# EAGLE design WyLight_v6 (EAGLE 6.4)
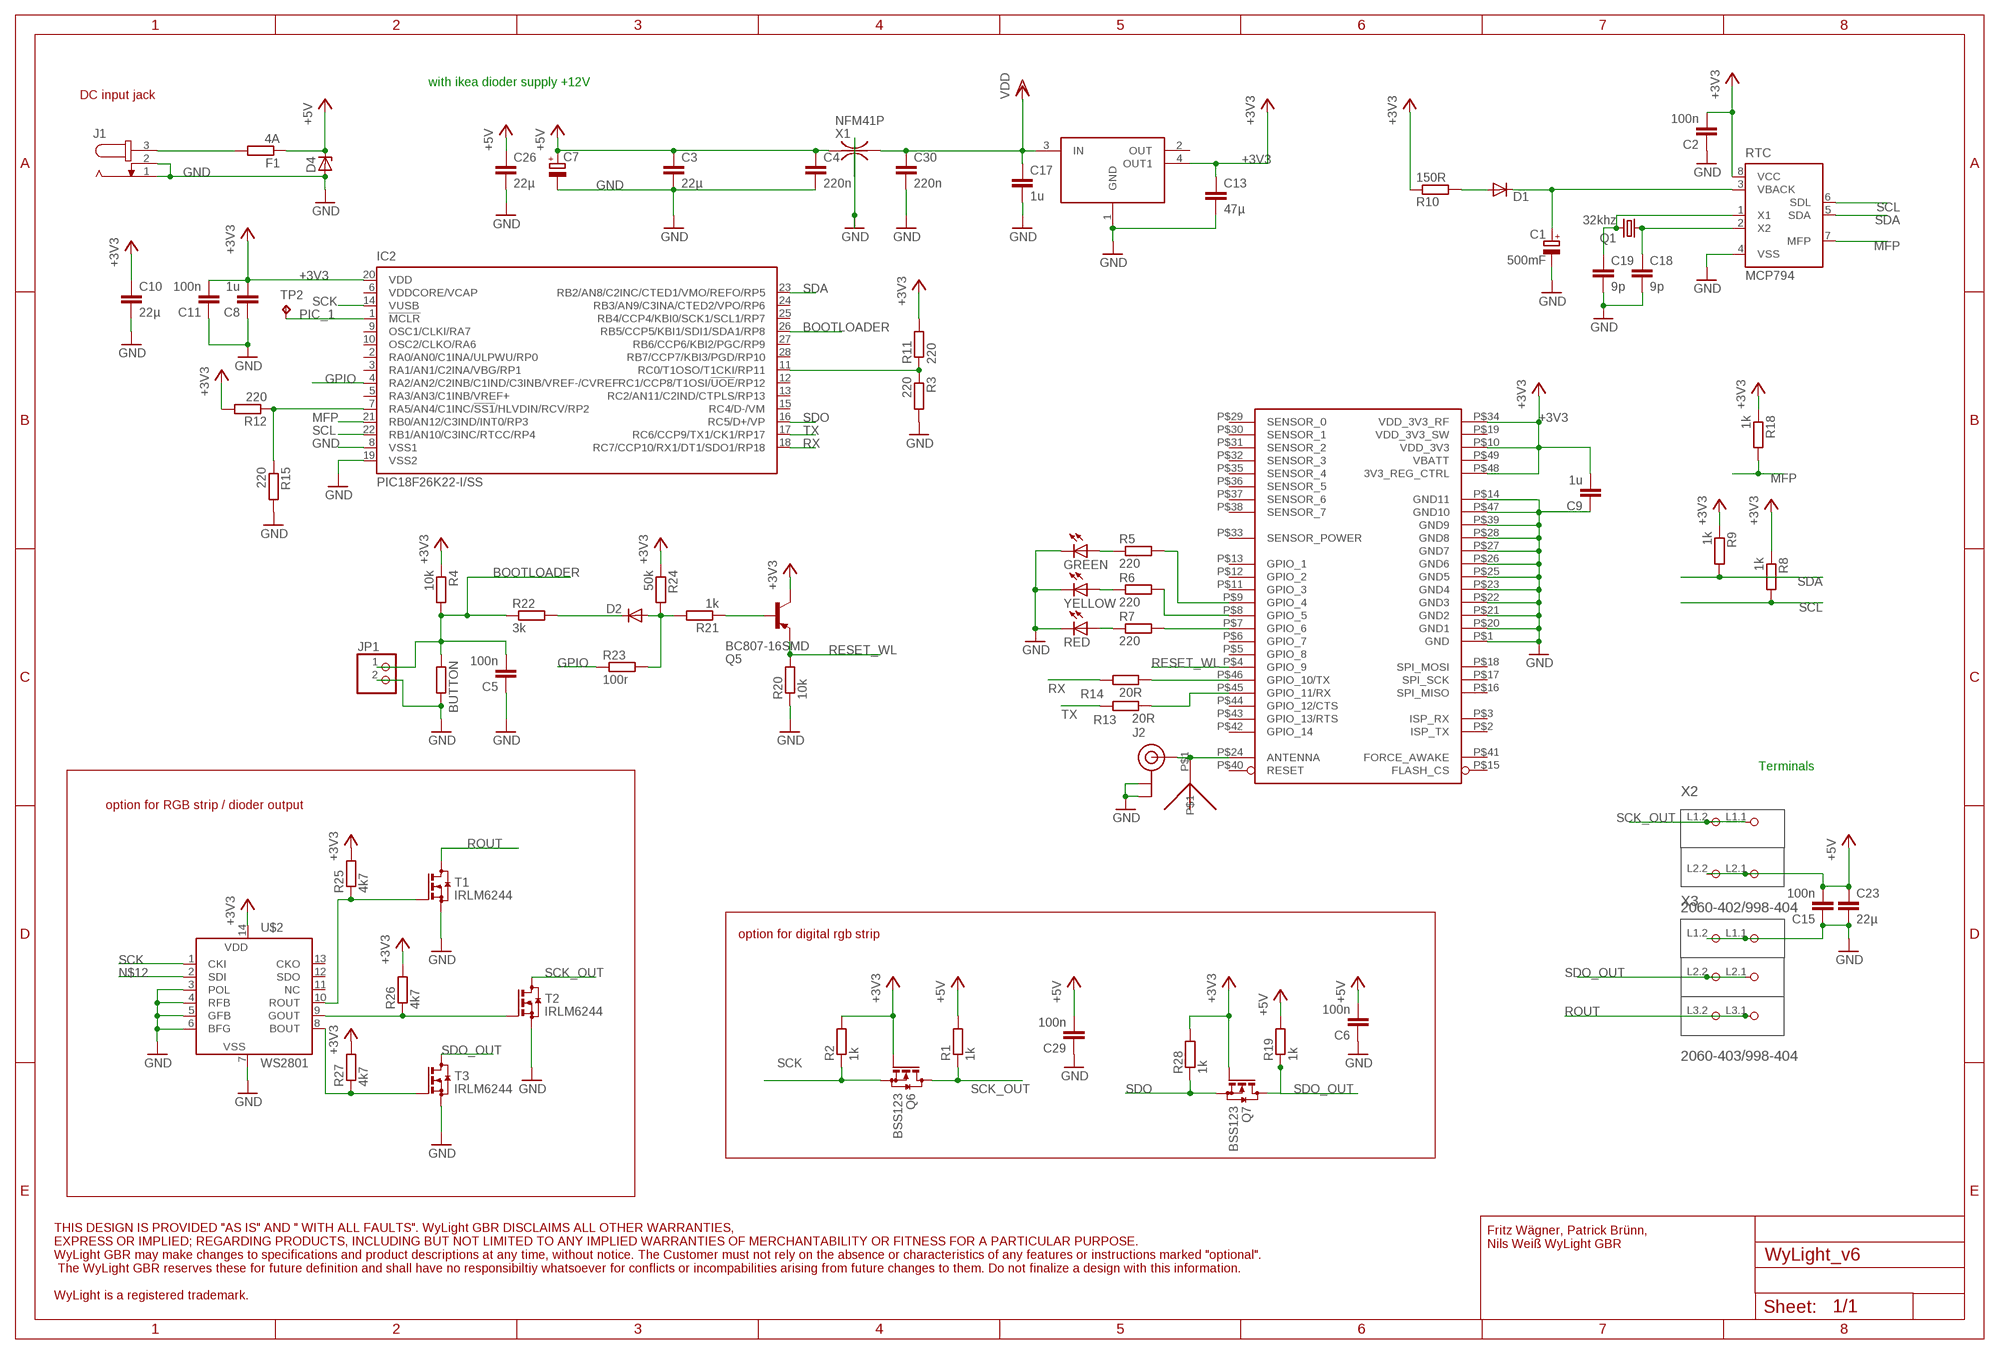
[diagram p0: schematic, sheet 1]

## Parts
BUTTON  R-EU_M2309  [M2309]
C1  500mF  CPOL-EUE5-10.5  [E5-10,5]
C2  100n  C-EUC0603K  [C0603K]
C3  22µ  C-EUC1210  [C1210]
C4  220n  C-EUC0603  [C0603]
C5  100n  C-EUC0603K  [C0603K]
C6  100n  C-EUC0603K  [C0603K]
C7  CPOL-EUC/6032-28R  [C/6032-28R]
C8  1u  C-EUC0603  [C0603]
C9  1u  C-EUC0603  [C0603]
C10  22µ  C-EUC1210  [C1210]
C11  100n  C-EUC0603  [C0603]
C13  47µ  C-EUC1210  [C1210]
C15  100n  C-EUC0603  [C0603]
C17  1u  C-EUC0603  [C0603]
C18  9p  C-EUC0603  [C0603]
C19  9p  C-EUC0603  [C0603]
C23  22µ  C-EUC1210  [C1210]
C26  22µ  C-EUC1210  [C1210]
C29  100n  C-EUC0603K  [C0603K]
C30  220n  C-EUC0603  [C0603]
D1  DIODE-SOD323-W  [SOD323-W]
D2  DIODE-SOD323-W  [SOD323-W]
D4  ZENER-DIODESMB  [SMB]
F1  4A  R-EU_M2309  [M2309]
GREEN  LEDCHIPLED_0603  [CHIPLED_0603]
IC2  PIC18F26K22-I/SS  PIC18F27J53SS  [SSOP28]
J1  JACK-PLUG0  [SPC4077]
J2  U.FL  [U.FL]
JP1  PINHD-1X2_2.00  [1X02M]
Q1  32khz  Q_SMD_32_15  [Q_SMD_32_1,5]
Q5  BC807-16SMD  [SOT23-BEC]
Q6  BSS123  [SOT23]
Q7  BSS123  [SOT23]
R1  1k  R-EU_R0603  [R0603]
R2  1k  R-EU_R0603  [R0603]
R3  220  R-EU_R0603  [R0603]
R4  10k  R-EU_R0603  [R0603]
R5  220  R-EU_R0603  [R0603]
R6  220  R-EU_R0603  [R0603]
R7  220  R-EU_R0603  [R0603]
R8  1k  R-EU_R0603  [R0603]
R9  1k  R-EU_R0603  [R0603]
R10  150R  R-EU_R0603  [R0603]
R11  220  R-EU_R0603  [R0603]
R12  220  R-EU_R0603  [R0603]
R13  20R  R-EU_R0603  [R0603]
R14  20R  R-EU_R0603  [R0603]
R15  220  R-EU_R0603  [R0603]
R18  1k  R-EU_R0603  [R0603]
R19  1k  R-EU_R0603  [R0603]
R20  10k  R-EU_R0603  [R0603]
R21  1k  R-EU_R0603  [R0603]
R22  3k  R-EU_R0603  [R0603]
R23  100r  R-EU_R0603  [R0603]
R24  50k  R-EU_R0603  [R0603]
R25  4k7  R-EU_R0603  [R0603]
R26  4k7  R-EU_R0603  [R0603]
R27  4k7  R-EU_R0603  [R0603]
R28  1k  R-EU_R0603  [R0603]
RED  LEDCHIPLED_0603  [CHIPLED_0603]
RTC  MCP794  [SO-08]
T1  IRLM6244  [SOT23]
T2  IRLM6244  [SOT23]
T3  IRLM6244  [SOT23]
TP2  TPB1,27  [B1,27]
U2  TLV1117  [SOT223]
U$1  RN171  RN-171  [WLAN_MOD_HAND]
U$2  WS2801  [SO14]
U$3  WE-MCAWE-MCA  [WE-MCA]
X1  NFM41P  [NFM41P]
X2  2060-402/998-404  [P-2060-402/998-404]
X3  2060-403/998-404  [P-2060-403/998-404]
YELLOW  LEDCHIPLED_0603  [CHIPLED_0603]

## Nets
+3V3: C2.2 C8.2 C9.2 C10.1 C11.2 C13.1 IC2.20(VDD) Q5.C Q6.1(G) Q7.1(G) R2.2 R4.1 R8.1 R9.1 R10.1 R11.2 R12.2 R18.1 R24.1 R25.2 R26.2 R27.2 R28.2 RTC.8(VCC) U2.4(OUT1) U$1.P$10(VDD_3V3) U$1.P$34(VDD_3V3_RF) U$1.P$48(3V3_REG_CTRL) U$2.14(VCC)
+5V: C3.1 C4.1 C6.2 C7.+ C15.2 C23.1 C26.1 C29.2 D4.C F1.1 R1.2 R19.2 X1.1 X2.L2.1(P2.1) X2.L2.2(P2.2)
BOOTLOADER: BUTTON.1 C5.2 IC2.26(RB5/CCP5/KBI1/SDI1/SDA1/RP8) JP1.1 R4.2 R22.1
GND: BUTTON.2 C1.- C2.1 C3.2 C4.2 C5.1 C6.1 C7.- C8.1 C9.1 C10.2 C11.1 C13.2 C15.1 C17.2 C18.2 C19.2 C23.2 C26.2 C29.1 C30.2 D4.A GREEN.C IC2.8(VSS1) IC2.19(VSS2) J1.1 J1.2 J2.P$1(GND) J2.P$2(GND) JP1.2 R3.2 R15.2 R20.1 RED.C RTC.4(VSS) T1.2(S) T2.2(S) T3.2(S) U2.1(GND) U$1.P$1(GND) U$1.P$14(GND11) U$1.P$20(GND1) U$1.P$21(GND2) U$1.P$22(GND3) U$1.P$23(GND4) U$1.P$25(GND5) U$1.P$26(GND6) U$1.P$27(GND7) U$1.P$28(GND8) U$1.P$39(GND9) U$1.P$47(GND10) U$2.3(POL) U$2.4(RFB) U$2.5(GFB) U$2.6(BFG) U$2.7(GND) X1.2@1 X1.2@2 X3.L1.1(P1.1) X3.L1.2(P1.2) YELLOW.C
GPIO: IC2.4(RA2/AN2/C2INB/C1IND/C3INB/VREF-/CVREF) R23.1
MFP: IC2.21(RB0/AN12/C3IND/INT0/RP3) R18.2 RTC.7(MFP)
N$1: F1.2 J1.3
N$2: J2.P$3(SIGNAL) U$1.P$24(ANTENNA) U$3.P$1
N$3: GREEN.A R5.1
N$4: R14.2 U$1.P$46(GPIO_10/TX)
N$5: R6.1 YELLOW.A
N$6: R7.1 RED.A
N$7: R7.2 U$1.P$7(GPIO_6)
N$8: R6.2 U$1.P$8(GPIO_5)
N$9: R5.2 U$1.P$9(GPIO_4)
N$10: C1.+ D1.C RTC.3(VBACK)
N$11: R13.2 U$1.P$45(GPIO_11/RX)
N$12: U$2.2(SDI)
N$13: D1.A R10.2
N$14: C19.1 Q1.2 RTC.1(X1)
N$15: IC2.7(RA5/AN4/C1INC/!SS1!/HLVDIN/RCV/RP2) R12.1 R15.1
N$16: IC2.11(RC0/T1OSO/T1CKI/RP11) R3.1 R11.1
N$19: C18.1 Q1.1 RTC.2(X2)
N$20: D2.C R22.2
N$22: R25.1 T1.1(G) U$2.10(ROUT)
N$23: R26.1 T2.1(G) U$2.9(GOUT)
N$24: R27.1 T3.1(G) U$2.8(BOUT)
N$25: Q5.B R21.1
N$26: D2.A R21.2 R23.2 R24.2
PIC_1: IC2.1(!MCLR) TP2.TP
RESET_WL: Q5.E R20.2 U$1.P$4(GPIO_9)
ROUT: T1.3(D) X3.L3.1(P3.1) X3.L3.2(P3.2)
RX: IC2.18(RC7/CCP10/RX1/DT1/SDO1/RP18) R14.1
SCK: IC2.14(VUSB) Q6.2(S) R2.1 U$2.1(CKI)
SCK_OUT: Q6.3(D) R1.1 T2.3(D) X2.L1.1(P1.1) X2.L1.2(P1.2)
SCL: IC2.22(RB1/AN10/C3INC/RTCC/RP4) R8.2 RTC.6(SDL)
SDA: IC2.23(RB2/AN8/C2INC/CTED1/VMO/REFO/RP5) R9.2 RTC.5(SDA)
SDO: IC2.16(RC5/D+/VP) Q7.2(S) R28.1
SDO_OUT: Q7.3(D) R19.1 T3.3(D) X3.L2.1(P2.1) X3.L2.2(P2.2)
TX: IC2.17(RC6/CCP9/TX1/CK1/RP17) R13.1
VDD: C17.1 C30.1 U2.3(IN) X1.3
Unconnected: IC2.2(RA0/AN0/C1INA/ULPWU/RP0) IC2.3(RA1/AN1/C2INA/VBG/RP1) IC2.5(RA3/AN3/C1INB/VREF+) IC2.6(VDDCORE/VCAP) IC2.9(OSC1/CLKI/RA7) IC2.10(OSC2/CLKO/RA6) IC2.12(RC1/CCP8/T1OSI/!UOE!/RP12) IC2.13(RC2/AN11/C2IND/CTPLS/RP13) IC2.15(RC4/D-/VM) IC2.24(RB3/AN9/C3INA/CTED2/VPO/RP6) IC2.25(RB4/CCP4/KBI0/SCK1/SCL1/RP7) IC2.27(RB6/CCP6/KBI2/PGC/RP9) IC2.28(RB7/CCP7/KBI3/PGD/RP10) U2.2(OUT) U$1.P$2(ISP_TX) U$1.P$3(ISP_RX) U$1.P$5(GPIO_8) U$1.P$6(GPIO_7) U$1.P$11(GPIO_3) U$1.P$12(GPIO_2) U$1.P$13(GPIO_1) U$1.P$15(FLASH_CS) U$1.P$16(SPI_MISO) U$1.P$17(SPI_SCK) U$1.P$18(SPI_MOSI) U$1.P$19(VDD_3V3_SW) U$1.P$29(SENSOR_0) U$1.P$30(SENSOR_1) U$1.P$31(SENSOR_2) U$1.P$32(SENSOR_3) U$1.P$33(SENSOR_POWER) U$1.P$35(SENSOR_4) U$1.P$36(SENSOR_5) U$1.P$37(SENSOR_6) U$1.P$38(SENSOR_7) U$1.P$40(RESET) U$1.P$41(FORCE_AWAKE) U$1.P$42(GPIO_14) U$1.P$43(GPIO_13/RTS) U$1.P$44(GPIO_12/CTS) U$1.P$49(VBATT) U$2.11(NC) U$2.12(SDO) U$2.13(CKO)

## Notes on the sheet
- with ikea dioder supply +12V
- DC input jack
- Terminals
- option for RGB strip / dioder output
- option for digital rgb strip
- Fritz Wägner, Patrick Brünn,
  Nils Weiß WyLight GBR
- THIS DESIGN IS PROVIDED "AS IS" AND " WITH ALL FAULTS". WyLight GBR DISCLAIMS ALL OTHER WARRANTIES,
  EXPRESS OR IMPLIED; REGARDING PRODUCTS, INCLUDING BUT NOT LIMITED TO ANY IMPLIED WARRANTIES OF MERCHANTABILITY OR FITNESS FOR A PARTICULAR PURPOSE.
  WyLight GBR may make changes to specifications and product descriptions at any time, without notice. The Customer must not rely on the absence or characteristics of any features or instructions marked "optional".
   The WyLight GBR reserves these for future definition and shall have no responsibiltiy whatsoever for conflicts or incompabilities arising from future changes to them. Do not finalize a design with this information. 
  
  WyLight is a registered trademark.

## Library data of the parts
BUTTON F1 R1-R15 R18-R28 = rcl:R-EU_: RESISTOR, European symbol
C1 C7 = rcl:CPOL-EU: POLARIZED CAPACITOR, European symbol
C2-C6 C8-C11 C13 C15 C17-C19 C23 C26 C29 C30 = rcl:C-EU: CAPACITOR, European symbol
D1 D2 = diode:DIODE-: DIODE
D4 = diode:ZENER-DIODE: Z-Diode
GREEN RED YELLOW = led:LED: LED OSRAM: - CHIPLED LG R971, LG N971, LY N971, LG Q971, LY Q971, LO R971, LY R971 LH N974, LH R974 LS Q976, LO Q976, LY Q976 LO Q996 - Hyper CHIPLED LW Q18S LB Q993, LB Q99A, LB R99A - SideLED LS A670, LO A670, LY A670, LG A670, LP A670 LB A673, LV A673, LT A673, LW A673 LH A674 LY A675 LS A676, LA A676, LO A676, LY A676, LW A676 LS A679, LY A679, LG A679 - Hyper Micro SIDELED® LS Y876, LA Y876, LO Y876, LY Y876 LT Y87S - SmartLED LW L88C, LW L88S LB L89C, LB L89S, LG L890 LS L89K, LO L89K, LY L89K LS L896, LA L896, LO L896, LY L896 - TOPLED LS T670, LO T670, LY T670, LG T670, LP T670 LSG T670, LSP T670, LSY T670, LOP T670, LYG T670 LG T671, LOG T671, LSG T671 LB T673, LV T673, LT T673, LW T673 LH T674 LS T676, LA T676, LO T676, LY T676, LB T676, LH T676, LSB T676, LW T676 LB T67C, LV T67C, LT T67C, LS T67K, LO T67K, LY T67K, LW E67C LS E67B, LA E67B, LO E67B, LY E67B, LB E67C, LV E67C, LT E67C LW T67C LS T679, LY T679, LG T679 LS T770, LO T770, LY T770, LG T770, LP T770 LB T773, LV T773, LT T773, LW T773 LH T774 LS E675, LA E675, LY E675, LS T675 LS T776, LA T776, LO T776, LY T776, LB T776 LHGB T686 LT T68C, LB T68C - Hyper Mini TOPLED® LB M676 - Mini TOPLED Santana® LG M470 LS M47K, LO M47K, LY M47K Source: http://www.osram.convergy.de LUXEON: - LUMILED® LXK2-PW12-R00, LXK2-PW12-S00, LXK2-PW14-U00, LXK2-PW14-V00 LXK2-PM12-R00, LXK2-PM12-S00, LXK2-PM14-U00 LXK2-PE12-Q00, LXK2-PE12-R00, LXK2-PE12-S00, LXK2-PE14-T00, LXK2-PE14-U00 LXK2-PB12-K00, LXK2-PB12-L00, LXK2-PB12-M00, LXK2-PB14-N00, LXK2-PB14-P00, LXK2-PB14-Q00 LXK2-PR12-L00, LXK2-PR12-M00, LXK2-PR14-Q00, LXK2-PR14-R00 LXK2-PD12-Q00, LXK2-PD12-R00, LXK2-PD12-S00 LXK2-PH12-R00, LXK2-PH12-S00 LXK2-PL12-P00, LXK2-PL12-Q00, LXK2-PL12-R00 Source: www.luxeon.com KINGBRIGHT: KA-3528ASYC Source: www.kingbright.com
IC2 = microchip:PIC18F2*J53: PIC18F47J53 Family High-Performance USB Microcontrollers with nanoWatt XLP Technology Source: Data sheet <http://ww1.microchip.com/downloads/en/DeviceDoc/39964B.pdf>; OC_FARNELL: unknown; OC_NEWARK: unknown
J1 = con-jack:JACK-PLUG: DC POWER JACK Power Jack, DC, Right Angle, Through Hole, Rated 5A at 16VDC, PC Terminals Distributor: Farnell (www.Farnell.de) Drawing: 84N1161.pdf / 84N1162.pdf Manufacturer: SPC Technology (www.spctechnology.com) Type: SPC4077 / SPC 4078; OC_FARNELL: unknown; OC_NEWARK: unknown
J2 = SparkFun-Connectors:U.FL: SMD antenna connector- WRL-09144; PROD_ID: CONN-09193
JP1 = pinhead_new:PINHD-1X2: PIN HEADER
Q1 = crystal:Q_SMD_32_15
Q5 = transistor-pnp:BC807*: PNP Transistror
Q6 Q7 = transistor-small-signal:BSS123: N-CHANNEL MOS FET
RTC = xicor2:MCP794
T1-T3 = transistor-small-signal:IRLM6244
TP2 = testpad:TP: Test pad
U2 = zetex:TLV1117
U$1 = RN-171:RN-171
U$2 = ws2801:WS2801
U$3 = WE-MCA:WE-MCA
X1 = murata-filter:NFM41P
X2 = con-wago_2060:2060-402/998-404: Serie 2060, SMD-Leiterplattenklemme mit Betätigungsdrückern im Gurt 2-polig / Series 2060, SMD terminal block with push-buttons in tape-and-reel packing 2-pole Polzahl / Pole No.: 2 Bemessungsspannung / Rated Voltage: 160 V Nennstrom / Nominal Current: 9 A Leiterquerschnitt / Conductor Size: 0.2 - 0.75 mm² Anschlusstechnik / Connection Technology: CAGE CLAMP® S Leitereinführung (zur Platine) / Conductor entry angle (to PCB): 0 ° Farbe / Color: lichtgrau / light gray Stand: 01.01.2012. Die jeweils aktuellen Daten zu diesem Artikel finden Sie in unserem Produktkatalog, den Sie unter www.wago.com einsehen können. As of: 01/01/2012. Please find the newest data for this article in our product catalogue, which can be viewed under www.wago.com.
X3 = con-wago_2060:2060-403/998-404: Serie 2060, SMD-Leiterplattenklemme mit Betätigungsdrückern im Gurt 3-polig / Series 2060, SMD terminal block with push-buttons in tape-and-reel packing 3-pole Polzahl / Pole No.: 3 Bemessungsspannung / Rated Voltage: 160 V Nennstrom / Nominal Current: 9 A Leiterquerschnitt / Conductor Size: 0.2 - 0.75 mm² Anschlusstechnik / Connection Technology: CAGE CLAMP® S Leitereinführung (zur Platine) / Conductor entry angle (to PCB): 0 ° Farbe / Color: lichtgrau / light gray Stand: 01.01.2012. Die jeweils aktuellen Daten zu diesem Artikel finden Sie in unserem Produktkatalog, den Sie unter www.wago.com einsehen können. As of: 01/01/2012. Please find the newest data for this article in our product catalogue, which can be viewed under www.wago.com.

## Board
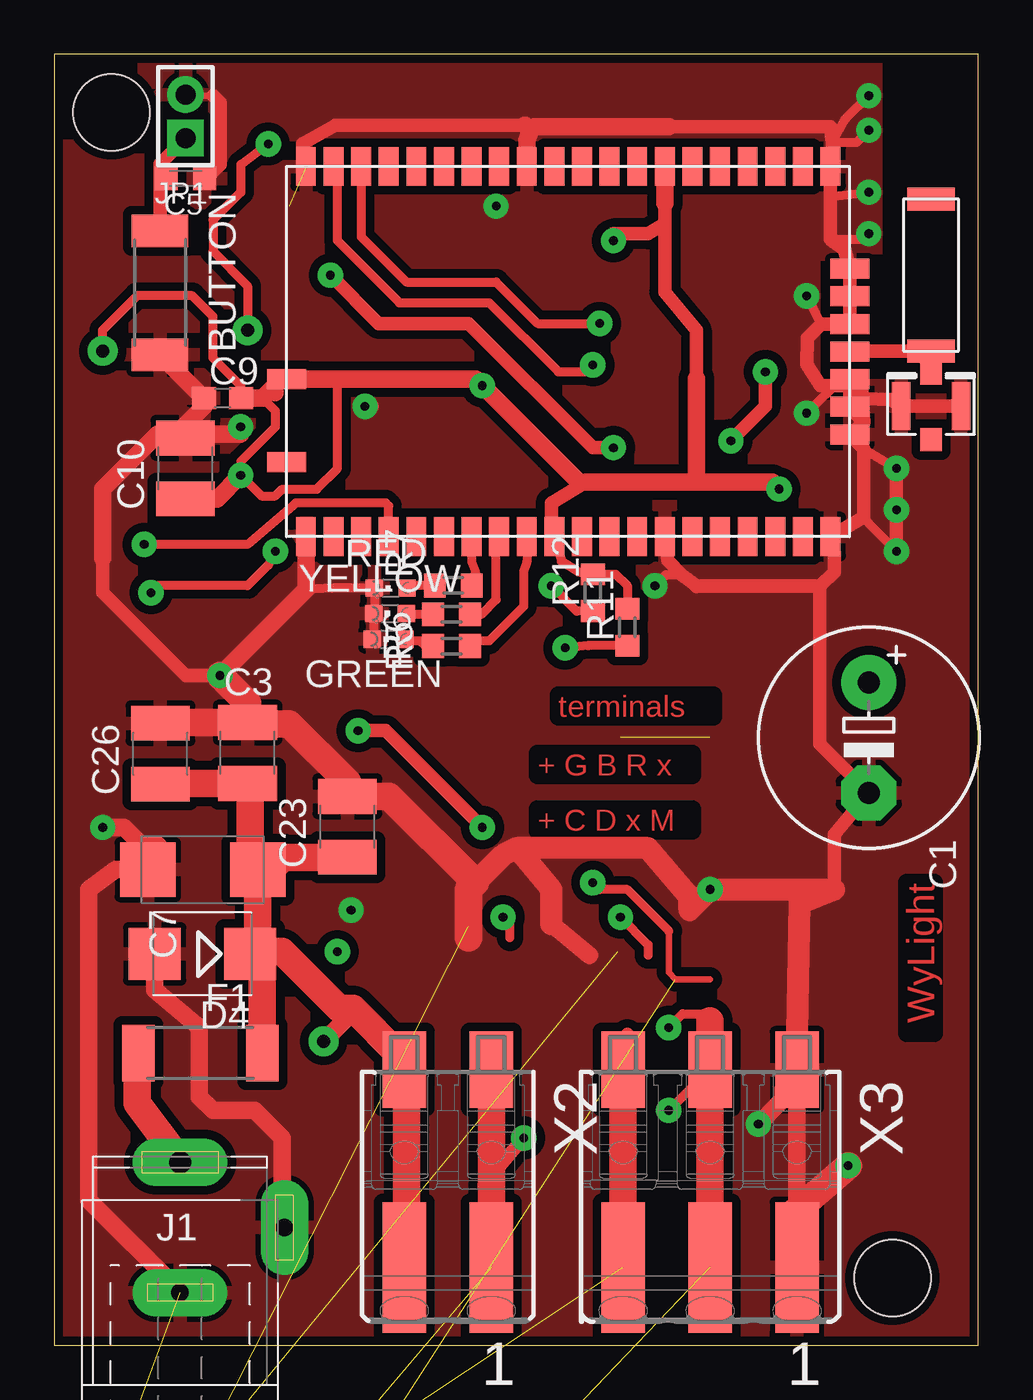
[diagram p1: board, top side]
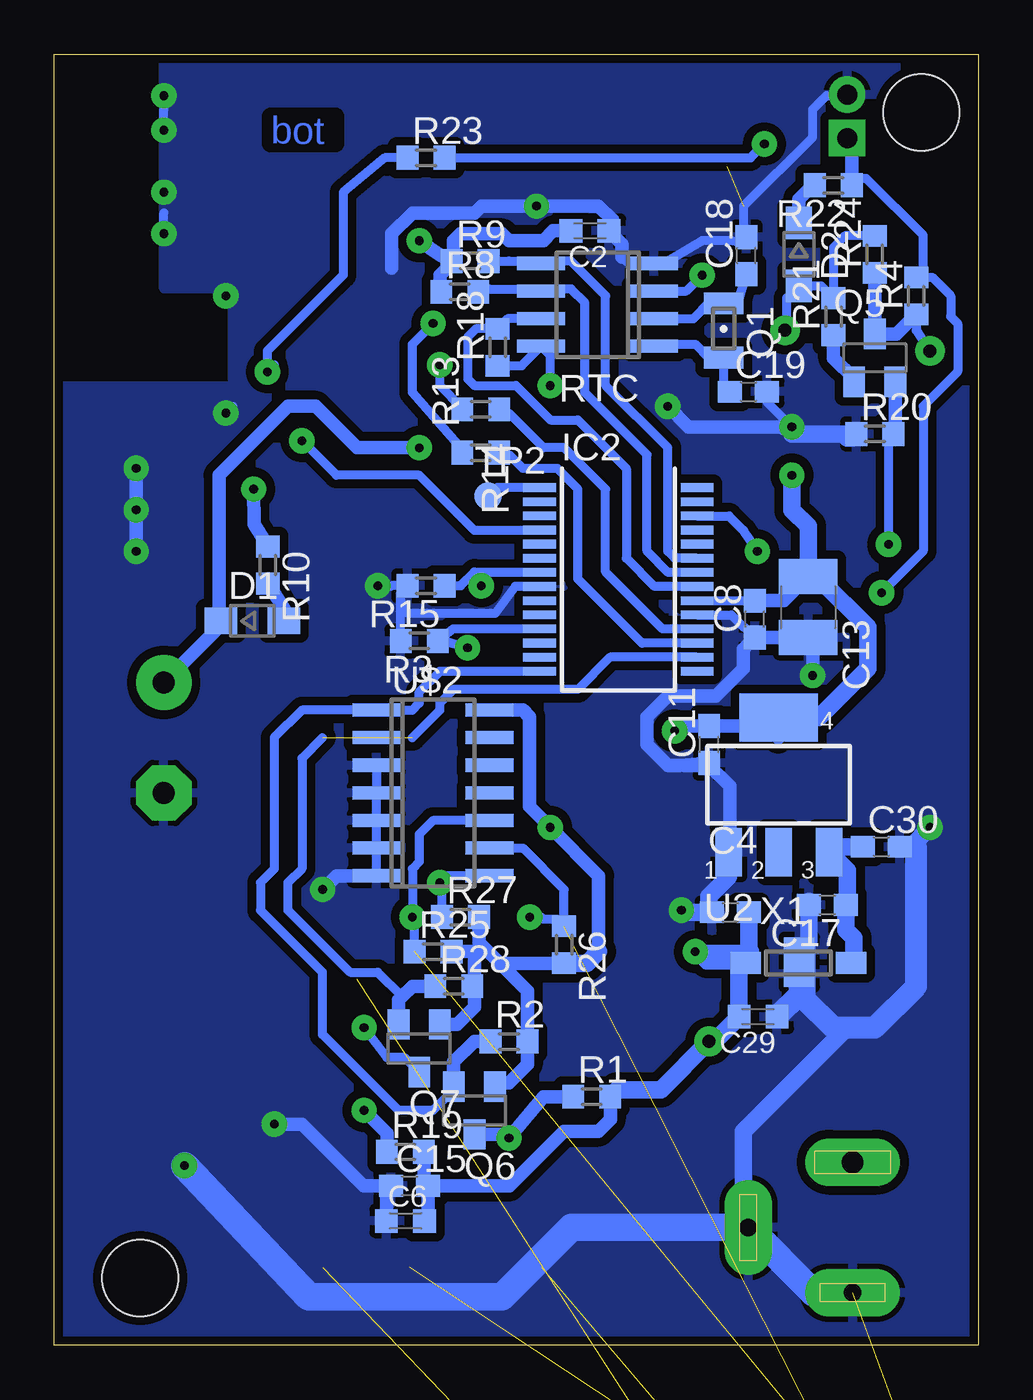
[diagram p2: board, bottom side, seen from below]

Size 42.5 x 59.37 mm. Coordinates in mm from the lower left corner, seen from the top.
Outline: 0,0 42.5,0 42.5,59.37 0,59.37 0,0
Copper layers (1*16): Top 0.035mm / dielectric 1.5mm / Bottom 0.035mm
Design rules "default *": minimum track width 8mil, minimum drill 0.4mm, track to track 8mil, track to pad 8mil, pad to pad 8mil, via to via 8mil, smd to smd 8mil, copper to edge 10mil, drill to drill 10mil, minimum pad ring 15mil, minimum via ring 15mil, stop-mask expansion 8mil, vias tented up to drill 0.6mm, thermal gap 10mil
Holes 3.5 mm at 38.55,3.08 2.62,56.69

### Footprints (pad centres in the part's own frame; a part is rotated, then mirrored left to right if it is on the bottom)
M2309 = smd 1.5 x 2.6: 1 -2.85,0; 2 2.85,0
E5-10,5 = drill 1.016 pad 2.54: + -2.54,0 | drill 1.016 pad 2.54 octagon: - 2.54,0
C0603K = smd 1.05 x 1.08: 1 -0.875,0; 2 0.875,0
C1210 = smd 1.6 x 2.7: 1 -1.4,0; 2 1.4,0
C0603 = smd 1.1 x 1: 1 -0.85,0; 2 0.85,0
C/6032-28R = smd 2.55 x 2.5: + 2.525,0; - -2.525,0
SOD323-W = smd 1.5 x 1.2: A 1.45,0; C -1.45,0
SMB = smd 2.4 x 2.4: A 2.2,0; C -2.2,0
CHIPLED_0603 = smd 0.8 x 0.8: A 0,-0.75; C 0,0.75
SSOP28 = smd 0.4 x 1.5: 1 -4.225,-3.625; 2 -3.575,-3.625; 3 -2.925,-3.625; 4 -2.275,-3.625; 5 -1.625,-3.625; 6 -0.975,-3.625; 7 -0.325,-3.625; 8 0.325,-3.625; 9 0.975,-3.625; 10 1.625,-3.625; 11 2.275,-3.625; 12 2.925,-3.625; 13 3.575,-3.625; 14 4.225,-3.625; 15 4.225,3.625; 16 3.575,3.625; 17 2.925,3.625; 18 2.275,3.625; 19 1.625,3.625; 20 0.975,3.625; 21 0.325,3.625; 22 -0.325,3.625; 23 -0.975,3.625; 24 -1.625,3.625; 25 -2.275,3.625; 26 -2.925,3.625; 27 -3.575,3.625; 28 -4.225,3.625
SPC4077 = drill 0.8 pad 2.184 long: 1 -3,0; 2 0,-4.8 | drill 1 pad 2.184 long: 3 3,0
U.FL = smd 2.2 x 0.85: P$1 0,1.375; P$2 0,-1.375 | smd 1.05 x 1: P$3 1.525,0; P$4 -1.525,0
1X02M = drill 0.914 square: 1 -1,0 | drill 0.914: 2 1,0
Q_SMD_32_1,5 = smd 1 x 1.8: 1 -1.167,0; 2 1.326,0
SOT23-BEC = smd 1 x 1.4: B -0.95,-1.1; C 0,1.1; E 0.95,-1.1
SOT23 = smd 1 x 1.4: 1 -0.95,-1.1; 2 0.95,-1.1; 3 0,1.1
R0603 = smd 1 x 1.1: 1 -0.85,0; 2 0.85,0
SO-08 = smd 0.6 x 2.2: 1 -1.905,-2.6; 2 -0.635,-2.6; 3 0.635,-2.6; 4 1.905,-2.6; 5 1.905,2.6; 6 0.635,2.6; 7 -0.635,2.6; 8 -1.905,2.6
B1,27 = smd 1.27 x 1.27: TP 0,0
SOT223 = smd 1.219 x 2.235: 1 -2.311,-3.099; 2 0,-3.099; 3 2.311,-3.099 | smd 3.6 x 2.2: 4 0,3.099
WLAN_MOD_HAND = smd 0.914 x 1.778: P$1 11.811,8.128; P$2 10.541,8.128; P$3 9.271,8.128; P$4 8.001,8.128; P$5 6.731,8.128; P$6 5.461,8.128; P$7 4.191,8.128; P$8 2.921,8.128; P$9 1.651,8.128; P$10 0.381,8.128; P$11 -0.889,8.128; P$12 -2.159,8.128; P$13 -3.429,8.128; P$14 -4.699,8.128; P$15 -5.969,8.128; P$16 -7.239,8.128; P$17 -8.509,8.128; P$18 -9.779,8.128; P$19 -11.049,8.128; P$20 -12.319,8.128; P$28 -12.319,-8.89; P$29 -11.049,-8.89; P$30 -9.779,-8.89; P$31 -8.509,-8.89; P$32 -7.239,-8.89; P$33 -5.969,-8.89; P$34 -4.699,-8.89; P$35 -3.429,-8.89; P$36 -2.159,-8.89; P$37 -0.889,-8.89; P$38 0.381,-8.89; P$39 1.651,-8.89; P$40 2.921,-8.89; P$41 4.191,-8.89; P$42 5.461,-8.89; P$43 6.731,-8.89; P$44 8.001,-8.89; P$45 9.271,-8.89; P$46 10.541,-8.89; P$47 11.811,-8.89 | smd 1.778 x 0.914: P$21 -13.208,3.429; P$22 -13.208,2.159; P$23 -13.208,0.889; P$24 -13.208,-0.381; P$25 -13.208,-1.651; P$26 -13.208,-2.921; P$27 -13.208,-4.191; P$48 12.7,0.889; P$49 12.7,4.699
SO14 = smd 0.6 x 2.2: 1 -3.81,-2.6; 2 -2.54,-2.6; 3 -1.27,-2.6; 4 0,-2.6; 5 1.27,-2.6; 6 2.54,-2.6; 7 3.81,-2.6; 8 3.81,2.6; 9 2.54,2.6; 10 1.27,2.6; 11 0,2.6; 12 -1.27,2.6; 13 -2.54,2.6; 14 -3.81,2.6
WE-MCA = smd 2.184 x 1.067: P$1 0,3.81; P$2 0,-3.175
NFM41P = smd 1.4 x 1: 1 -2.426,0; 3 2.426,0 | smd 1.4 x 1.2: 2@1 0.033,-0.508; 2@2 0.033,0.575
P-2060-402/998-404 = smd 6 x 2: L1.1 4.05,2; L2.1 4.05,-2 | smd 3.5 x 2: L1.2 -5.05,2; L2.2 -5.05,-2
P-2060-403/998-404 = smd 6 x 2: L1.1 4.05,4; L2.1 4.05,0; L3.1 4.05,-4 | smd 3.5 x 2: L1.2 -5.05,4; L2.2 -5.05,0; L3.2 -5.05,-4

### Placement (x,y rotation side)
BUTTON  4.87,48.4 270 top
C1  37.47,27.94 270 top
C2  17.86,51.24 180 bottom
C3  8.89,27.24 90 top
C4  11.4,19.91 180 bottom
C5  6.03,53.66 180 top
C6  26.35,5.71 0 bottom
C7  6.83,21.87 0 top
C8  10.28,33.38 90 bottom
C9  7.75,43.55 0 top
C10  6.03,40.32 90 top
C11  12.38,27.62 90 bottom
C13  7.83,33.95 270 bottom
C15  26.17,7.33 0 bottom
C17  6.93,20.25 180 bottom
C18  10.66,50.12 90 bottom
C19  10.57,43.84 0 bottom
C23  13.48,23.84 90 top
C26  4.88,27.2 90 top
C29  10.13,15.11 180 bottom
C30  4.46,22.92 0 bottom
D1  33.39,33.31 0 bottom
D2  8.26,50.16 270 bottom
D4  6.81,17.99 180 top
F1  6.71,13.44 180 top
GREEN  15.38,32.47 90 top
IC2  16.56,35.22 270 bottom
J1  5.78,5.41 90 top
J2  40.32,43.18 90 top
JP1  6.03,56.52 90 top
Q1  11.71,46.74 270 bottom
Q5  4.76,45.4 0 bottom
Q6  23.18,10.79 180 bottom
Q7  25.72,13.65 180 bottom
R1  17.78,11.43 0 bottom
R2  21.59,13.97 0 bottom
R3  25.72,32.38 180 bottom
R4  2.86,48.26 90 bottom
R5  18.27,32.15 0 top
R6  18.27,33.61 0 top
R7  18.35,34.94 0 top
R8  23.85,48.44 0 bottom
R9  23.38,49.85 0 bottom
R10  32.68,35.88 270 bottom
R11  26.35,33.02 90 top
R12  24.77,34.61 90 top
R13  22.89,41.05 180 bottom
R14  22.89,43.04 180 bottom
R15  25.4,34.92 180 bottom
R18  22.11,45.89 90 bottom
R19  26.35,8.89 0 bottom
R20  4.76,41.91 0 bottom
R21  6.67,47.31 90 bottom
R22  6.67,53.34 180 bottom
R23  25.4,54.61 0 bottom
R24  4.76,50.16 90 bottom
R25  25.08,18.1 0 bottom
R26  19.05,18.41 270 bottom
R27  23.81,19.68 0 bottom
R28  24.13,16.51 0 bottom
RED  15.47,34.82 90 top
RTC  17.51,47.84 90 bottom
T1  -2.54,-16.51 0 top  (outside the outline)
T2  -2.54,-24.13 0 top  (outside the outline)
T3  -2.54,-31.75 0 top  (outside the outline)
TP2  22.54,39.05 0 bottom
U2  9.18,25.77 0 bottom
U$1  23.38,45.31 180 top
U$2  25.08,25.4 270 bottom
U$3  40.32,49.53 180 top
X1  8.28,17.58 0 bottom
X2  18.1,7.62 270 top
X3  30.16,7.62 270 top
YELLOW  15.44,33.65 90 top

### Tracks (layer width: path | path; a pad name or v marks a point on that pad's centre or on a via)
+3V3  (via drill 0.4, 0.6)
  Top 0.406: v2.22,45.72 2.22,46.67 3.81,48.26 6.35,48.26 7.3,47.31 7.3,45.4 8.57,44.13 8.57,43.58 C9.2 | U$1.P$10 23.32,36.06 24.13,35.56 24.66,35.56 R12.2 25.82,35.46 26.35,34.92 R11.2 | v8.57,40.01 8.57,40.32 | 9.58,43.55 10.16,42.98 10.16,42.23 8.57,40.64 v8.57,40.01 | v8.57,40.01 9.53,39.05 10.16,39.05 10.48,39.37 12.06,39.37 13.02,40.32 13.02,44.13 12.7,44.45 13.02,44.45
  Top 0.61: 33.02,39.69 v33.34,39.37 | U$1.P$10 22.86,37.33 22.86,38.73 24.45,39.69 24.13,39.69 | 19.39,44.43 v19.68,44.13 | v13.97,28.26 15.24,28.26 v19.68,23.81 | 28.08,52.53 28.08,51.57 | 28.08,51.57 27.3,51.12 25.72,51.12 v25.72,50.8 | 28.08,51.57 28.08,48.44 29.53,46.67 29.53,44.45
  Top 0.813: U$1.P$34 28.08,52.53 | 29.53,39.69 33.02,39.69 | 29.53,39.69 24.45,39.69 | 19.39,44.43 U$1.P$48 11.29,44.45 10.48,44.45 10,43.97 | 24.13,39.69 v19.68,44.13 | 29.53,39.69 29.53,44.45 | C10.1 7.49,38.92 v8.57,40.01 | 8.57,43.53 C9.2 9.58,43.55 10,43.97 | 10.16,43.81 10,43.97
  Bottom 0.406: 20.22,45.83 RTC.8 | RTC.8 19.68,45.51 v19.68,44.13 19.8,44.24 | R4.1 2.86,46.67 v2.22,45.72 | IC2.20 C8.2 | R18.1 21.01,45.04 RTC.8 | R9.1 24.35,50.11
  Bottom 0.61: R4.1 3.77,46.5 Q5.C R24.1 | C8.2 8.94,34.23 C13.1 | U2.4 9.58,28.47 C11.2 13.44,28.47 v13.97,28.26 | 9.21,27.91 8.26,28.87 | Q7.1 23.98,14.75 23.18,15.56 23.18,16.41 R28.2 23.18,16.61 23.18,17.78 22.86,18.1 | R26.2 22.01,17.57 | 22.01,17.57 22.54,18.1 | 22.54,18.1 22.96,18.52 R27.2 | 22.01,17.57 20.74,16.3 R2.2 20.74,12.91 21.59,12.06 22.06,12.06 Q6.1 | R25.2 22.86,18.1 | 22.86,18.1 22.54,18.1 | R10.1 33.31,37.76 v33.34,39.37 | U$2.14 20.95,29.21 20.64,28.89 20.64,24.77 v19.68,23.81 17.46,21.59 17.46,18.1 | C2.2 19.56,51.24 20,50.8 21.59,50.8 21.91,51.12 23.81,51.12 24.13,50.8 24.13,49.95 R9.1 24.23,49.75 24.77,49.21 24.77,48.5 R8.1 | 24.35,50.11 24.71,50.11 v25.72,50.8
  Bottom 0.813: 10.53,28.47 U2.4 8.26,28.87 7.33,28.87 5.08,31.11 5.08,33.02 7.3,35.24 7.72,35.24 C13.1 7.83,37.67 8.57,38.42 v8.57,40.01 | R26.2 18,17.57 17.46,18.1
+5V  (via drill 0.4, 0.6)
  Top 0.813: 13.73,15.48 13.73,15.32 v12.38,13.97
  Top 1.27: 16.19,12.06 15.88,12.38 15.88,13.34 13.73,15.48 13.1,15.48 10.48,18.1 9.12,18.1 D4.C | 16.19,12.06 16.19,12.57 X2.L2.2 | 16.19,12.06 16.19,3.67 X2.L2.1 | F1.1 9.56,17.59 D4.C | 9.22,17.78 D4.C | 9.35,21.27 C7.+ 9.01,22.8 9.01,25.71 C3.1 4.91,25.84 C26.1 | 9.35,21.27 9.35,18.34 D4.C | C23.1 10.52,22.44 9.35,21.27
  Bottom 0.61: 10.48,18.1 v13.02,18.1 12.5,17.58 X1.1 | R1.2 16.93,10.38 17.46,9.84 19.05,9.84 21.57,7.33 C15.2 | R19.2 25.5,7.51 C15.2 | C15.2 25.32,5.87 C6.2
  Bottom 0.813: X1.1 11.01,17.28 C29.2 12.14,13.97 v12.38,13.97 14.61,11.75 16.61,11.75 R1.2 | C4.1 10.55,18.17 10.48,18.1
BOOTLOADER  (via drill 0.4)
  Top 0.305: 6.08,55.47 JP1.1
  Top 0.406: v10.16,36.51 9.84,35.88 8.89,34.92 4.76,34.92 v4.45,34.61
  Top 0.61: BUTTON.1 4.87,53.37 | 4.87,53.37 C5.2 | 4.87,53.37 4.87,54.35 JP1.1
  Bottom 0.305: 2.54,49.43 R4.2
  Bottom 0.406: IC2.26 11.47,38.14 10.79,37.47 v10.16,36.51 | v4.45,34.61 2.54,36.51 2.54,43.18 0.95,44.77 0.95,46.99 1.27,47.31 1.27,48.26 2.12,49.11 R4.2 | 5.71,55.2 JP1.1 | 2.54,49.43 2.54,51.04 C5.2 5.5,53.66 R22.1
  Bottom 0.61: R22.1 5.82,55.3 JP1.1
GND  (via drill 0.4, 0.4 pad 0.81)  (4 unrouted)
  Top 0.305: 7.3,57.47 6.08,57.47 JP1.2
  Top 0.406: 36.59,43.52 37.22,43.52 U$1.P$22 | 29.17,35.19 28.94,35.42 28.86,35.42 28.12,35.42 v27.62,34.92 | v37.47,57.47 36.41,56.42 35.78,55.33 36.91,55.33 v37.47,55.88 | 35.7,50.86 37.21,50.86 v37.47,51.12 | 35.7,52.82 35.67,52.82 v37.47,53.02 | 37.22,41.2 v38.73,40.32 | 35.27,46.97 34.64,48.23 v34.61,48.26 | 35.9,44.12 34.95,43.2 v34.61,42.86 | v38.73,36.51 37.49,37.76 37.22,38.08 | 33.94,12.67 X3.L1.2 33.34,11.85 33.34,11.11 | GREEN.C 14.69,32.52 YELLOW.C 14.72,33.69 RED.C 12.77,34.82 11.57,34.75
  Top 0.61: U$1.P$14 28.23,36.08 28.86,35.42 29.55,34.9 | 37.22,42.42 U$1.P$21 37.22,41.2 37.22,38.08 U$1.P$20 35.88,36.37 35.88,35.56 35.22,34.9 | 37.22,42.42 U$1.P$22 36.59,43.52 U$1.P$23 | 28.26,56.05 35.69,56.05 35.78,55.33 35.78,54.29 U$1.P$28 35.7,52.82 35.7,50.86 36.33,50.4 U$1.P$27 U$1.P$26 U$1.P$25 35.27,46.97 34.63,46.33 34.61,45.09 35.24,44.12 35.9,44.12 37.19,44.11 37.12,44.11 37.22,42.42 | 21.66,56.11 12.93,56.11 11.43,55.24 11.43,54.34 U$1.P$47 | 29.55,34.9 35.22,34.9 | 29.53,34.88 29.55,34.9 | C5.1 6.99,53.66 7.62,54.29 7.62,57.15 7.3,57.47 | 2.22,36.2 2.22,34.61 6.03,30.8 v7.62,30.8 | 35.22,34.9 35.22,27.65 C1.- 35.88,23.5 35.88,20.95 | v38.73,40.32 v38.73,38.42 v38.73,36.51 | 37.22,43.52 38.47,43.5 J2.P$1 J2.P$2 | v14.29,43.18 14.61,43.18
  Top 0.813: 28.26,56.05 22.08,56.05 21.91,55.88 | U$1.P$39 21.73,55.42 21.91,55.88 | 21.91,55.88 21.88,55.88 21.66,56.11 | 4.55,45.82 BUTTON.2 6.86,43.55 C9.1 6.9,43.2 R20.1 | X3.L1.1 X3.L1.2 | 2.22,36.2 2.22,39.37 4.76,41.91 R20.1 | D4.A 4.61,16.34 6.67,14.61 6.67,11.43 7.3,10.79 9.21,10.79 10.48,9.53 10.48,5.52 J1.2 | 33.34,11.11 v32.38,10.16 | 24.62,17.93 22.86,19.37 | v2.22,23.81 3.22,23.81 4.51,22.52 | C7.- 2.82,21.87 1.59,20.95 1.59,6.67 5.71,2.54 6.35,2.54 | U$1.P$1 11.57,34.75 v7.62,30.8 | R20.1 5.84,41.91 | 5.84,41.91 C10.2 | 5.84,41.91 8.57,41.91 v8.57,42.23
  Top 1.016: X3.L1.2 34.16,13.21 34.29,20.32 35.88,20.95 v30.16,20.95 29.21,20 29.21,20.64 27.3,22.86 21.27,22.86 | 21.27,22.86 20.64,22.54 19.05,20.96 | 22.86,19.37 22.86,20.95 21.27,22.86
  Top 1.27: 4.61,22.83 4.51,22.52 C7.- | 19.05,18.74 19.05,18.73 19.05,20.96 19.37,21.27 15.4,25.24 C23.2 13.48,25.89 10.79,28.57 8.95,28.57 C3.2 | C3.2 4.91,28.64 C26.2 | C3.2 8.89,29.53 v7.62,30.8 | X3.L1.1 34.05,6.11 v36.51,8.26
  Bottom 0.406: 16.38,50.04 16.19,49.85 15.01,49.85 RTC.4 14.81,49.85 14.29,49.85 12.7,50.8 11.43,50.8 10.64,50.65 C18.2 10.79,51.09 10.79,52.39 7.62,55.56 7.62,56.83 6.99,57.47 6.08,57.47 JP1.2 | U$2.3 U$2.4 U$2.5 U$2.6 U$2.7 | v27.62,34.92 27.02,34.89 26.99,34.92 R15.2 26.57,34.61 26.57,34.29 | v37.47,57.47 37.47,57.78 | v37.47,51.12 37.47,52.07 | v37.47,55.88 37.47,56.83 | v37.47,53.02 37.47,53.34 | v34.61,48.26 34.61,48.58 | v34.61,42.86 34.29,43.18 | IC2.19 11.37,33.59 10.79,33.02 10.76,33.02 C8.1 | R3.2 26.57,34.29 | IC2.8 21.31,34.89 22.23,33.66 26.25,33.66 26.57,34.29 | C19.2 9.72,43.38 v8.57,42.23
  Bottom 0.61: U2.1 11.43,22.73 11.43,25.72 12.38,26.67 13.55,26.67 C11.1 13.76,26.67 14.29,26.67 15.24,27.62 15.24,28.89 14.29,29.84 12.06,29.84 10.79,31.11 10.79,32.02 C8.1 7.84,32.53 C13.2 7.62,32.34 v7.62,30.8 | v38.73,40.32 v38.73,38.42 v38.73,36.51 | U$2.7 29.53,21.59 v30.16,20.95 | v32.38,10.16 31.11,10.16 28.28,7.33 C15.1 27.23,7.12 C6.1 | 8.89,42.23 13.34,42.23 v14.29,43.18 | 26.99,49.53 26.99,51.12 26.04,52.07 23.18,52.07 22.86,52.39 v20.32,52.39 17.46,52.39 16.83,51.75 16.83,51.4 C2.1 16.38,50.64 16.38,50.04
  Bottom 0.813: C4.2 13.56,19.91 v13.65,20 | 12.45,20.11 C4.2 | 2.86,22.86 2.92,22.92 C30.2 3.12,22.92 v2.22,23.81 | U2.1 11.49,21.53 12.38,20.64 12.38,20.04 C4.2 | 4.76,14.61 6.03,14.61 10.79,9.84 10.79,5.62 J1.2 | C17.2 7.79,18.61 X1.2@2 | 8.89,42.23 v8.57,42.23 8.57,41.91 6.22,41.91 C10.2 5.8,41.72 R20.1
  Bottom 1.016: C17.2 7.79,20.3 | C29.1 8.24,16.12 X1.2@1 X1.2@2 8.13,18.16 7.99,18.3 7.99,15.93 6.67,14.61 4.76,14.61 2.86,16.51 2.86,22.86
  Bottom 1.27: J1.1 7.58,2.41 J1.2 18.72,5.41 21.91,2.22 30.8,2.22 v36.51,8.26
  pour Top (isolate 0.406): 0.32,0.32 42.23,0.32 42.23,0.64 42.23,44.13 34.92,44.13 34.92,50.16 37.78,50.16 37.78,59.05 0.32,59.05
  pour Bottom (isolate 0.406): 0,59.37 0,0 42.55,0 42.55,0.32 42.55,44.13 34.29,44.13 34.29,48.58 37.47,48.58 37.47,59.37
GPIO  (via drill 0.4)
  Top 0.61: v32.7,44.77 32.7,43.18 v31.11,41.59
  Bottom 0.406: IC2.4 20.21,37.47 23.18,37.47 25.72,40.01 29.53,40.01 v31.11,41.59 | 32.38,45.09 v32.7,44.77 32.7,45.72 29.21,49.21 29.21,53.02 27.3,54.61 R23.1
MFP
  Bottom 0.406: IC2.21 14.89,34.89 16.19,36.2 16.19,40.32 18.41,42.55 19.68,42.55 21.27,44.13 23.18,44.13 23.5,44.45 23.5,46.35 23.11,46.74 R18.2 21.64,47.21 RTC.7
N$1
  Top 1.27: J1.3 5.78,8.51 3.81,11.11 3.81,13.07 F1.2
N$2
  Top 0.406: U$3.P$1 J2.P$3
  Top 0.61: U$1.P$24 37.25,45.72 39.69,45.72 40.07,45.34 J2.P$3
N$3
  Top 0.406: R5.1 17.06,32.15 16.83,32.38 16.21,32.38 GREEN.A
N$4  (via drill 0.4)
  Top 0.406: U$1.P$46 13.02,54.07 13.02,50.8 15.88,47.94 20,47.94 23.18,44.77 24.45,44.77 v24.77,45.09
  Bottom 0.406: R14.2 23.74,43.1 24.77,44.13 v24.77,45.09
N$5
  Top 0.406: R6.1 16.23,33.61 YELLOW.A
N$6
  Top 0.406: R7.1 16.35,34.94 RED.A
N$7
  Top 0.406: U$1.P$7 19.19,36.02 19.37,35.56 19.37,35.11 R7.2
N$8
  Top 0.406: R6.2 19.64,33.61 20.32,34.29 20.32,36.37 U$1.P$8
  Top 0.61: 20.48,36.85 U$1.P$8
N$9
  Top 0.406: U$1.P$9 21.73,36.02 21.59,35.56 21.59,33.97 20,32.38 19.35,32.38 R5.2
N$10  (via drill 0.4)
  Top 0.406: 13.02,48.9 v12.7,49.21
  Top 0.61: v25.72,41.27 24.77,41.27 19.05,46.99 14.92,46.99 v12.7,49.21
  Bottom 0.406: RTC.3 13.43,48.48 v12.7,49.21
  Bottom 0.61: v25.72,41.27 28.57,41.27 30.48,43.18 31.75,43.18 34.92,40.01 34.92,33.6 34.84,33.52 D1.C 34.84,33.1 C1.+
N$11  (via drill 0.4)
  Top 0.406: U$1.P$45 14.11,50.98 16.19,48.9 20.32,48.9 22.23,46.99 v25.08,46.99
  Bottom 0.406: R13.2 23.74,41.2 26.04,43.81 26.04,46.04 v25.08,46.99
N$13
  Bottom 0.406: 31.73,33.53 D1.A
  Bottom 0.61: R10.2 31.73,33.53
N$14
  Bottom 0.406: RTC.1 14.81,46.04 13.02,46.04 12.38,45.4 11.73,45.4 | 11.73,45.4 Q1.2 | 11.73,45.4 11.73,44.15 C19.1
N$15  (via drill 0.4)
  Top 0.406: R12.1 24.03,33.76 v22.86,34.92
  Bottom 0.406: R15.1 23.81,34.92 23.18,35.56 23.16,35.54 | IC2.7 23.16,35.54 | v22.86,34.92 22.86,35.24 23.16,35.54
N$16  (via drill 0.4)
  Top 0.406: R11.1 24.55,32.17 v23.5,32.07
  Bottom 0.406: IC2.11 24.15,32.94 R3.1 24.87,32.49 v23.5,32.07
N$19
  Bottom 0.406: RTC.2 13.12,47.21 12.38,47.94 11.74,47.94 Q1.1 11.06,47.91 C18.1
N$20
  Bottom 0.61: R22.2 7.62,53.34 8.26,52.7 D2.C
N$22  (via drill 0.4)  (1 unrouted)
  Top 0.406: 27.3,17.93 27.3,18.41 v26.04,19.68
  Bottom 0.406: R25.1 25.93,19.27 v26.04,19.68 26.04,21.91 25.72,22.23 25.72,23.5 25.08,24.13 U$2.10
N$23  (via drill 0.4)  (1 unrouted)
  Top 0.406: 20.95,18.73 20.95,19.37 v20.64,19.68
  Bottom 0.406: v20.64,19.68 20.11,19.68 20,19.58 19.37,19.58 R26.1 19.05,20.95 20.95,22.86 U$2.9
N$24  (via drill 0.4)  (1 unrouted)
  Top 0.305: 30.16,16.83 28.57,16.83 28.26,17.14 28.26,19.05
  Top 0.406: 28.26,19.05 26.35,20.95 25.08,20.95 v24.77,21.27
  Bottom 0.406: R27.1 24.66,21.17 v24.77,21.27 24.45,21.59 U$2.8
N$25
  Bottom 0.61: Q5.B 5.71,44.45 6.67,45.4 R21.1
N$26  (via drill 0.4, 0.6)
  Top 0.406: v9.84,55.24 8.57,54.29 8.57,53.02 7.3,51.75 7.3,50.3 8.89,48.72 v8.89,46.67
  Bottom 0.406: R24.2 6.13,51.02 6.67,50.48 R21.2 7.22,48.72 D2.A 8.81,48.16 8.81,47.07 v8.89,46.67 | R23.2 10.48,54.61 v9.84,55.24
PIC_1
  Bottom 0.406: IC2.1 22.16,39.44 TP2.TP
RESET_WL  (via drill 0.4)
  Top 0.406: U$1.P$4 15.38,38.6 15.24,38.73 11.11,38.73 8.89,36.83 v4.13,36.83
  Bottom 0.406: v4.13,36.83 4.13,41.7 R20.2
  Bottom 0.61: Q5.E 3.81,42.01 R20.2
ROUT  (1 unrouted)
  Top 0.61: X3.L3.2 26.04,12.8 26.04,13.97 26.35,14.29
  Top 1.27: X3.L3.1 X3.L3.2 26.35,12.86
RX
  Bottom 0.406: IC2.18 14.53,32.94 17.14,35.56 17.14,39.37 19.05,41.27 20,41.27 21.59,42.86 21.86,42.86 R14.1
SCK
  Bottom 0.406: IC2.14 24.77,30.99 25.72,30.04 25.72,29.53 26.04,29.21 U$2.1 31.11,29.21 32.38,27.94 32.38,21.91 33.02,21.27 33.02,20 30.16,17.14 30.16,14.29 26.67,10.79 25.08,10.79 24.13,11.75 Q6.2
  Bottom 0.61: R2.1 23.18,13.97 24.13,13.02 Q6.2
SCK_OUT  (via drill 0.4)  (1 unrouted)
  Top 0.61: 19.86,12.91 X2.L1.2 | X2.L1.1 19.76,7.38 v21.59,9.53
  Top 1.27: X2.L1.1 X2.L1.2 20,12.77
  Bottom 0.61: Q6.3 21.76,9.7 v21.59,9.53 20,11.43 R1.1
SCL
  Bottom 0.406: IC2.22 14.27,35.54 15.24,36.51 15.24,40.96 18.1,43.81 18.1,47.94 18.73,48.58 20.02,48.58 RTC.6 20.21,48.58 22.51,48.58 R8.2
SDA
  Bottom 0.406: IC2.23 13.96,36.19 14.29,36.51 14.29,41.27 17.14,44.13 17.14,48.26 18.73,49.85 20.02,49.85 RTC.5 20.21,49.85 21.27,49.85 21.6,49.85 R9.2
SDO  (1 unrouted)
  Bottom 0.406: IC2.16 16.94,31.64 18.41,30.16 24.13,30.16 24.77,29.53 24.77,29.21 26.04,27.94 | 30.16,27.94 31.11,26.99 31.11,21.91 31.75,21.27 31.75,20 28.89,17.14 27.62,17.14 26.51,16.03
  Bottom 0.61: Q7.2 26.67,15.88 26.51,16.03 26.04,16.51 R28.1
SDO_OUT  (via drill 0.4)  (1 unrouted)
  Top 0.406: v28.26,14.61 28.89,15.24 29.84,15.24 30.16,14.92 | X3.L2.2 30.13,12.67 v28.26,10.79
  Top 0.813: X3.L2.2 30.16,13.97
  Top 1.27: X3.L2.1 X3.L2.2 30.16,14.92
  Bottom 0.406: Q7.3 26.4,13.23 27.2,13.23 v28.26,14.61 27.94,14.29
  Bottom 0.61: R19.1 27.2,9.74 v28.26,10.79
TX
  Bottom 0.406: IC2.17 15.46,32.29 18.41,35.24 18.41,39.37 19.37,40.32 20.95,40.32 21.59,40.96 21.95,40.96 R13.1
VDD
  Bottom 0.813: X1.3 5.71,17.71 5.71,18.73 6.08,19.1 C17.1 6.03,20.3 6.03,21.83 U2.3 6.62,22.92 C30.1

### Text on the board
Top: terminals | + G B R x | + C D x M | WyLight
Bottom: bot